# EasyEDA Pro project ProPrj_Decatron_2026-03-23.epro

# Schematic Schematic1
Board Name: Old; Create Date: 2024-11-02; Page Name: P1; Project Name: Decatron; Schematic Name: Schematic1; Update Date: 2026-03-20; Add into BOM: yes; Convert to PCB: yes; Drawed: MacLaod; Page Size: A4; Version: 2.1
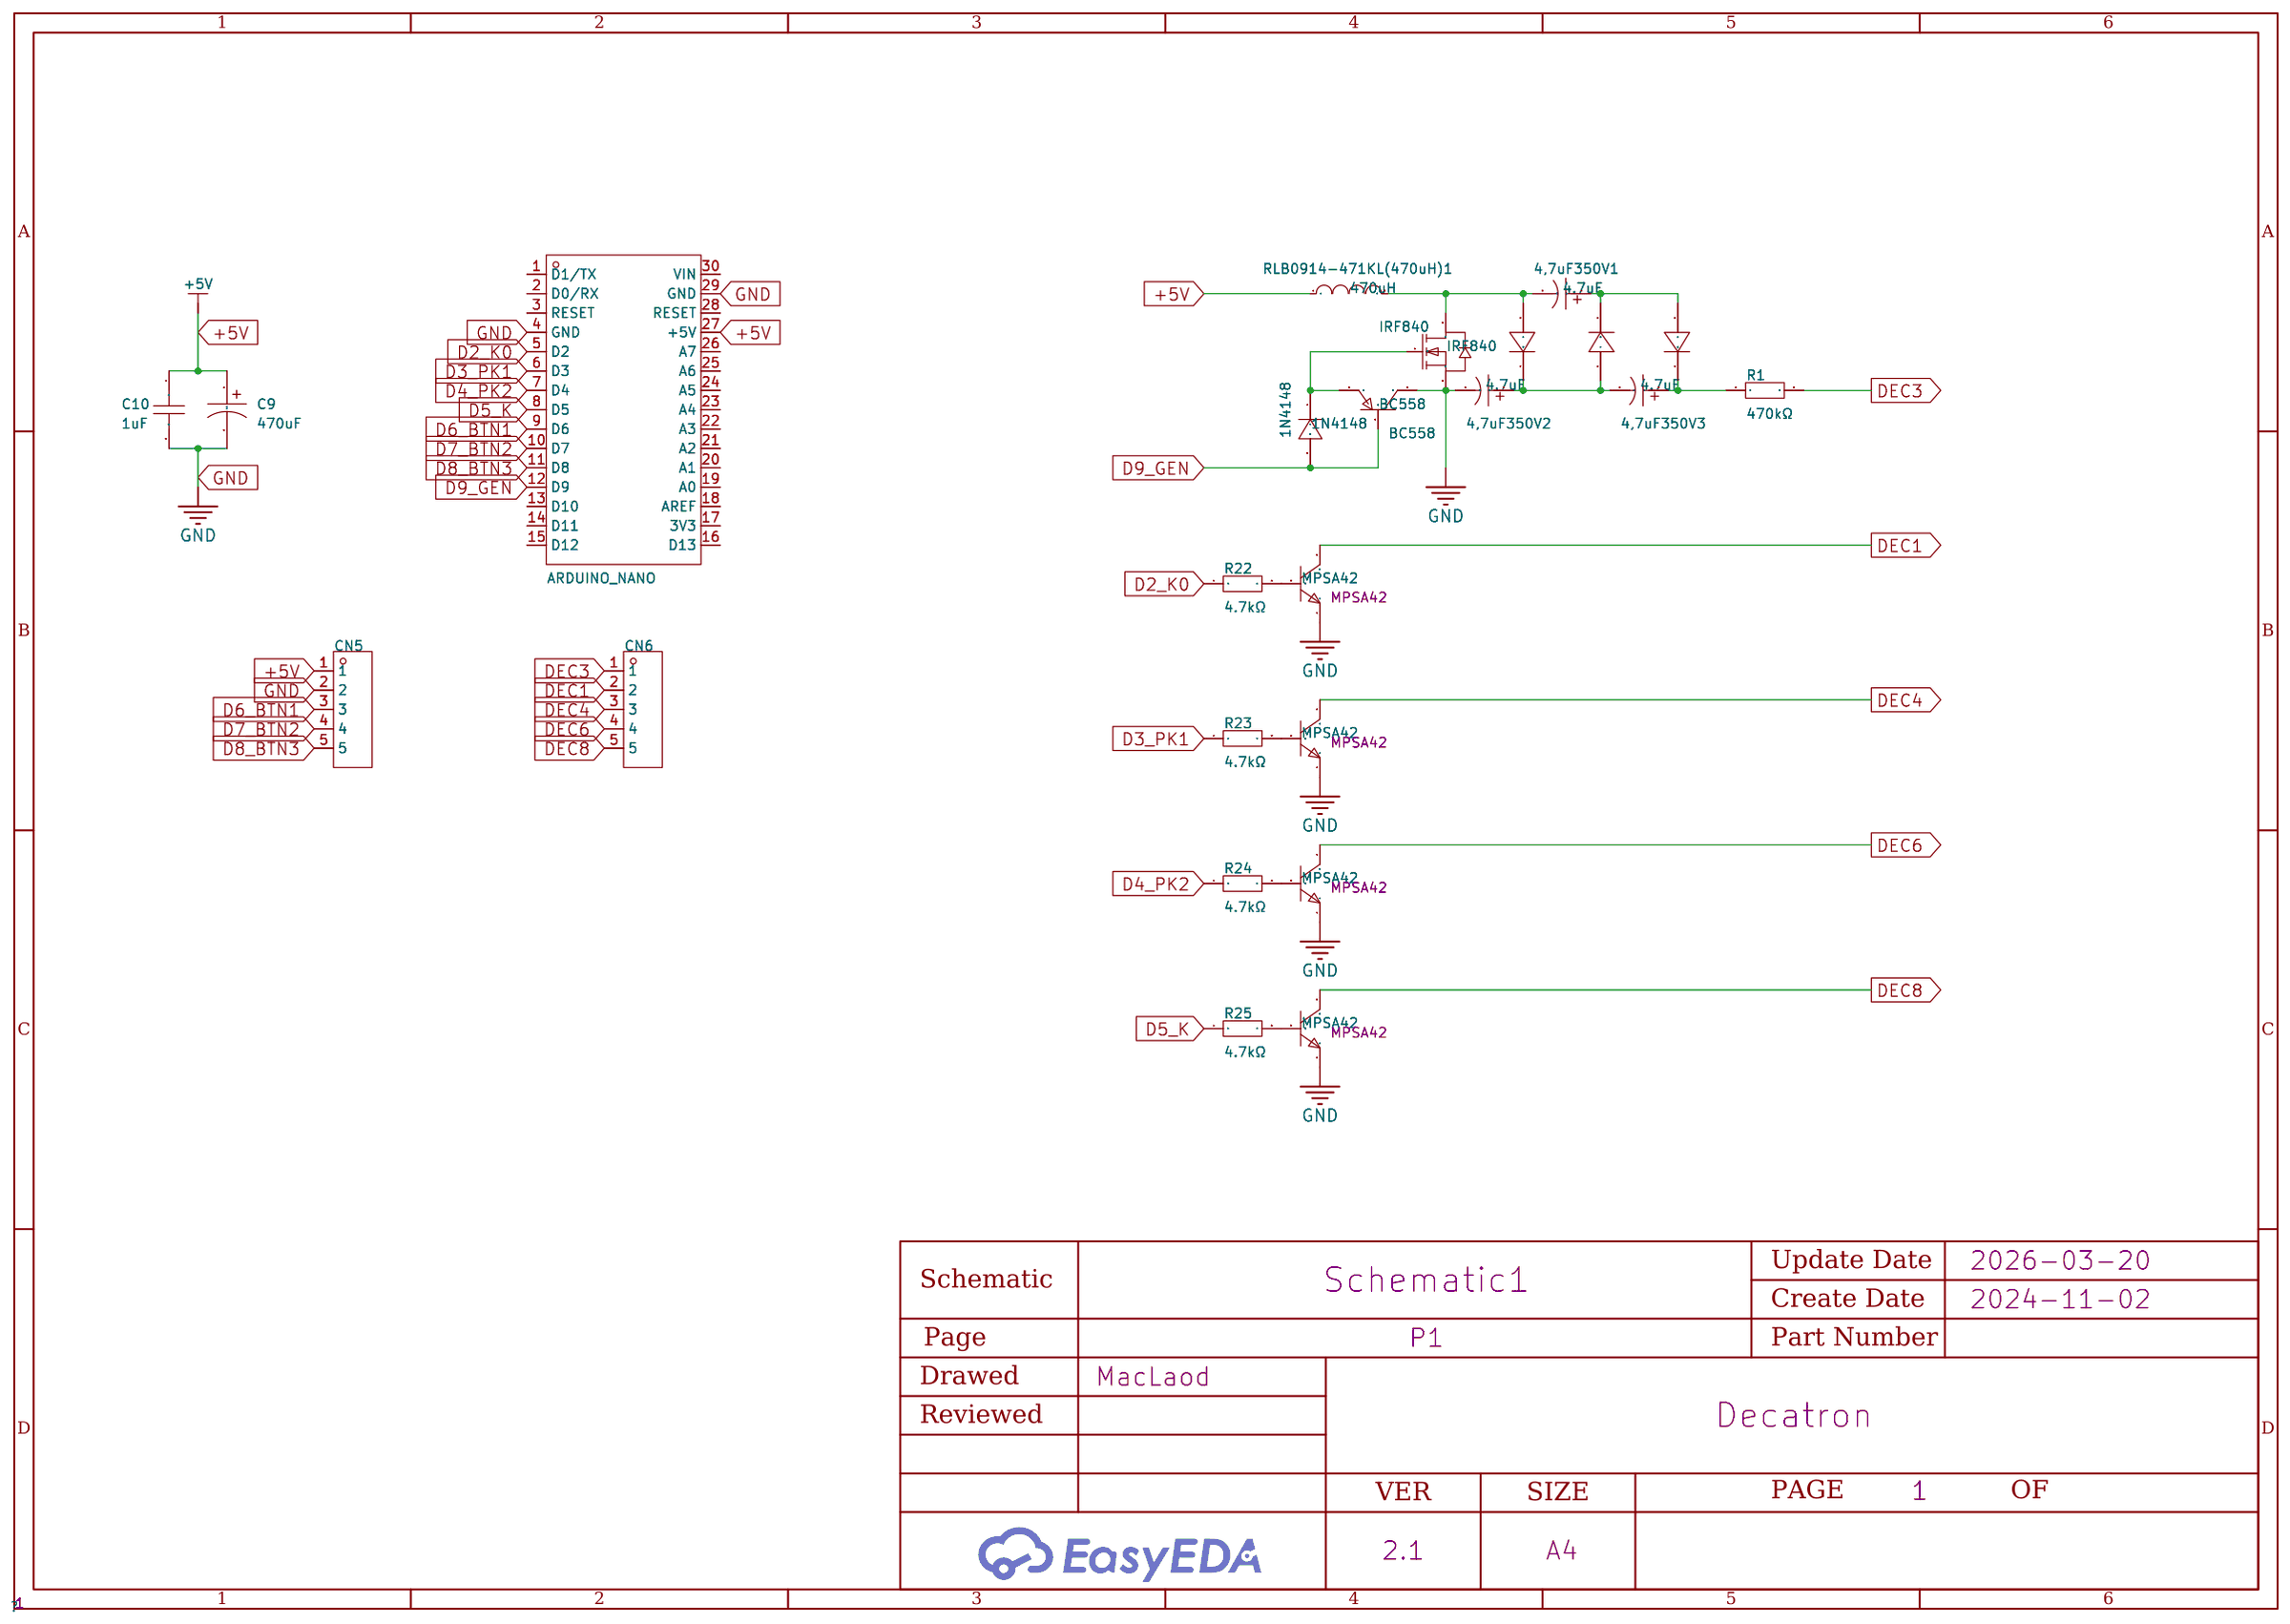
[diagram p0: schematic sheet]

## Parts
1N4148  1N4148  [DO-35_BD2.0-L4.0-P8.00-D0.5-FD]
4,7uF350V1  4.7uF  [CAP-TH_BD8.0-P3.50-D0.6-FD_1]
4,7uF350V2  4.7uF  [CAP-TH_BD8.0-P3.50-D0.6-FD_1]
4,7uF350V3  4.7uF  [CAP-TH_BD8.0-P3.50-D0.6-FD_1]
BC558  BC558  [TO-92-3_L4.5-W3.5-P1.27-L]
C9  470uF  [CAP-TH_BD6.3-P2.50-D1.0-FD]
C10  1uF  [C0805]
CN5  HX PM2.54-1x5P ZC-Y  [HDR-TH_5P-P2.54-V-F-3]
CN6  HX PM2.54-1x5P ZC-Y  [HDR-TH_5P-P2.54-V-F-3]
IRF840  IRF840  [TO-220AB-3_L10.4-W4.6-P2.54-L]
Q1  MPSA42  [TO-92-3_L4.9-W3.7-P1.27-L]
Q2  MPSA42  [TO-92-3_L4.9-W3.7-P1.27-L]
Q3  MPSA42  [TO-92-3_L4.9-W3.7-P1.27-L]
Q4  MPSA42  [TO-92-3_L4.9-W3.7-P1.27-L]
R1  470kΩ  [RES-TH_BD2.3-L6.5-P10.50-D0.5]
R22  4.7kΩ  [RES-TH_BD2.3-L6.5-P10.50-D0.5]
R23  4.7kΩ  [RES-TH_BD2.3-L6.5-P10.50-D0.5]
R24  4.7kΩ  [RES-TH_BD2.3-L6.5-P10.50-D0.5]
R25  4.7kΩ  [RES-TH_BD2.3-L6.5-P10.50-D0.5]
RLB0914-471KL(470uH)1  470uH  [IND-TH_BD8.7-P5.0-D0.7_RLB0914]
SF1  SF18  [DO-41_BD2.4-L4.7-P8.70-D0.9-FD]
SF2  SF18  [DO-41_BD2.4-L4.7-P8.70-D0.9-FD]
SF18  SF18  [DO-41_BD2.4-L4.7-P8.70-D0.9-FD]
U3  ARDUINO_NANO  [COMM-TH_ARDUINO_NANO]

## Library data of the parts
1N4148 = 1N4148_C14516: Diode Configuration: Forward Voltage (Vf@If):1V@10mA Reverse Voltage (Vr): Average Rectified Current (Io): Power Dissipation: Reverse Leakage Current:5uA@75V Reverse Recovery Time (trr): Operating Temperature:- Operating Temperature:-; LCSC Part Name: 电压:75V 电流:200mA; Supplier Part: C14516; Manufacturer: ST(先科); Supplier Footprint: DO-35; JLCPCB Part Class: Extended Part; Datasheet: https://atta.szlcsc.com/upload/public/pdf/source/20140303/1457707005030.pdf; Supplier: LCSC; Forward Voltage (Vf@If): 1V@10mA; Reverse Leakage Current: 5uA@75V
4,7uF350V1-4,7uF350V3 = 87EC0068: Capacitance: Tolerance:±20% Tolerance:±20% Rated Voltage: Ripple Current:150mA@100kHz Equivalent Series Resistance(ESR):3Ω@100kHz Lead Spacing: φD: L: Lifetime @ Temp:10000hrs@105℃ Operating Temperature:-25℃~+105℃ Operating Temperature:-25℃~+105℃; LCSC Part Name: 4.7uF ±20% 400V; Supplier Part: C2687411; Manufacturer: KNSCHA(科尼盛); Supplier Footprint: 插件,D8xL12mm; JLCPCB Part Class: Extended Part; Datasheet: https://atta.szlcsc.com/upload/public/pdf/source/20210128/C2687411_47D152122E02B3F51C123914ADA73DFA.pdf; Supplier: LCSC; Tolerance: ±20%; Ripple Current: 150mA@100kHz; Equivalent Series Resistance(ESR): 3Ω@100kHz; Lifetime @ Temp: 10000hrs@105℃; Operating Temperature: -25℃~+105℃; Check: true
BC558 = BC558: Transistor Type:PNP; LCSC Part Name: PNP; Supplier Part: C2992048; Manufacturer: CJ(江苏长电/长晶); Supplier Footprint: TO-92-3; JLCPCB Part Class: Extended Part; Datasheet: https://atta.szlcsc.com/upload/public/pdf/source/20220322/DC27FE3E0FF921B85DFD6DFB131647DC.pdf; Supplier: LCSC; Transistor Type: PNP; Check: true
C9 = SHW470UF6.3V6.3X11: Capacitance:470uF Tolerance:±20% Tolerance:±20% Voltage Rating:6.3V Ripple Current:- Equivalent Series Resistance(ESR):- Pin Spacing:2.5mm Diameter:6.3mm Height - Seated (Max):11mm Lifetime:10000hrs@105℃; LCSC Part Name: 470uF ±20% 6.3V 停产; Supplier Part: C494546; Manufacturer: KNSCHA(科尼盛); Supplier Footprint: 插件,D6.3xL11mm; JLCPCB Part Class: Extended Part; Datasheet: https://item.szlcsc.com/datasheet/SHW470UF6.3V6.3X11/505122.html; Supplier: LCSC; Tolerance: ±20%; Voltage Rating: 6.3V; Pin Spacing: 2.5mm; Diameter: 6.3mm; Height - Seated (Max): 11mm; Lifetime: 10000hrs@105℃
C10 = 0805B105K500NT_C215803: Capacitance:1uF Tolerance:±10% Tolerance:±10% Voltage Rating:50V Temperature Coefficient:X7R; LCSC Part Name: 1uF ±10% 50V; Supplier Part: C215803; Manufacturer: FH(风华); Manufacturer Part: 0805B105K500NT; Supplier Footprint: 0805; JLCPCB Part Class: Extended Part; Datasheet: https://item.szlcsc.com/datasheet/0805B105K500NT/216551.html; Supplier: LCSC; Tolerance: ±10%; Voltage Rating: 50V; Temperature Coefficient: X7R
CN5 CN6 = HX PM2.54-1x5P ZC-Y: Holes Structure:1x5P Pitch:2.54mm Row Spacing:- Circular Hole / Square Hole:Square Hole Mounting Type:Through Hole Number of Rows:1 Number of Positions:5P Current Rating:3A Voltage Rating (Max):1kV Holes Direction:Top Insulation Height:8.5mm Contact Mater; LCSC Part Name: 1x5P 间距:2.54mm 直插; Supplier Part: C22438155; Manufacturer: hanxia(韩下); Supplier Footprint: 插件,P=2.54mm; JLCPCB Part Class: Extended Part; Datasheet: https://item.szlcsc.com/datasheet/HX%2520PM2.54-1x5P%2520ZC-Y/24075302.html; Supplier: LCSC; Holes Structure: 1x5P; Pitch: 2.54mm; Circular Hole / Square Hole: Square Hole; Mounting Type: Through Hole; Number of Rows: 1; Number of Positions: 5P; Current Rating: 3A; Voltage Rating (Max): 1kV; Holes Direction: Top; Insulation Height: 8.5mm; Contact Material: Phosphor Bronze; Contact Plating: Gold; Operating Temperature: -40℃~+105℃; PIN Length: 3.2mm
IRF840 = IRF840_C3280796: Type:1个NChannel Drain Source Voltage (Vdss): Continuous Drain Current (Id): Power Dissipation (Pd): Drain Source On Resistance (RDS(on)@Vgs,Id): Gate Threshold Voltage (Vgs(th)@Id):4V@250uA Total Gate Charge (Qg@Vgs):63nC@10V Input Capacitance (Ciss@Vds):; LCSC Part Name: 1个N沟道 耐压:500V 电流:8A; Supplier Part: C3280796; Manufacturer: MOTOROLA(摩托罗拉); Supplier Footprint: TO-220AB; JLCPCB Part Class: Extended Part; Supplier: LCSC; Type: 1个NChannel; Gate Threshold Voltage (Vgs(th)@Id): 4V@250uA; Total Gate Charge (Qg@Vgs): 63nC@10V; Input Capacitance (Ciss@Vds): 1.3nF@25V; Operating Temperature: -55℃~+150℃@(Tj)
Q1-Q4 = MPSA42_C2978815: type:NPN Current - Collector(Ic):500mA Collector - Emitter Voltage VCEO:300V Pd - Power Dissipation:625mW Transition frequency(fT):50MHz Current - Collector Cutoff:100nA Vce Saturation(VCE(sat)):500mV@20mA,2mA Emitter-Base Voltage(Vebo):6V; Supplier Part: C2978815; Manufacturer: EIC; Supplier Footprint: TO-92; JLCPCB Part Class: Extended Part; Datasheet: https://item.szlcsc.com/datasheet/MPSA42/3393640.html; Supplier: LCSC; type: NPN; Current - Collector(Ic): 500mA; Collector - Emitter Voltage VCEO: 300V; Pd - Power Dissipation: 625mW; Transition frequency(fT): 50MHz; Current - Collector Cutoff: 100nA; Vce Saturation(VCE(sat)): 500mV@20mA,2mA; Emitter-Base Voltage(Vebo): 6V
R1 = MF1/4W-470KΩ±1% T: Type:Metal Film Resistors Resistance: Tolerance:±1% Tolerance:±1% Overload Voltage (Max):250V Power(Watts):250mW Temperature Coefficient:±100ppm/℃ Temperature Coefficient:±100ppm/℃ Operating Temperature Range:-55℃~+155℃ Operating Temperature Range:-55℃~+1; LCSC Part Name: 470kΩ ±1% 250mW 金属膜电阻; Supplier Part: C119381; Manufacturer: CCO(千志电子); Supplier Footprint: 插件,D2.3xL6.5mm; JLCPCB Part Class: Extended Part; Datasheet: https://atta.szlcsc.com/upload/public/pdf/source/20190910/C427326_62A6D058BC0FF74963A2F22379CA06CE.pdf; Supplier: LCSC; Type: Metal Film Resistors; Tolerance: ±1%; Overload Voltage (Max): 250V; Power(Watts): 250mW; Temperature Coefficient: ±100ppm/℃; Operating Temperature Range: -55℃~+155℃; Check: true
R22-R25 = MF1/4W-4.7KΩ±1% T: Type:Metal Film Resistors Resistance: Tolerance:±1% Tolerance:±1% Overload Voltage (Max):250V Power(Watts):250mW Temperature Coefficient:±100ppm/℃ Temperature Coefficient:±100ppm/℃ Operating Temperature Range:-55℃~+155℃ Operating Temperature Range:-55℃~+1; LCSC Part Name: 4.7kΩ ±1% 250mW 金属膜电阻; Supplier Part: C119339; Manufacturer: CCO(千志电子); Supplier Footprint: 插件,D2.3xL6.5mm; JLCPCB Part Class: Extended Part; Datasheet: https://atta.szlcsc.com/upload/public/pdf/source/20190910/C427326_62A6D058BC0FF74963A2F22379CA06CE.pdf; Supplier: LCSC; Type: Metal Film Resistors; Tolerance: ±1%; Overload Voltage (Max): 250V; Power(Watts): 250mW; Temperature Coefficient: ±100ppm/℃; Operating Temperature Range: -55℃~+155℃; Check: true
RLB0914-471KL(470uH)1 = RLB0914-471KL: Inductance: Tolerance:±10% Tolerance:±10% Rated Current: Saturation Current (Isat):1A DC Resistance (DCR):; LCSC Part Name: 470uH ±10% 1A; Supplier Part: C7051049; Manufacturer: BOURNS; Supplier Footprint: 插件,D=8.7mm; JLCPCB Part Class: Extended Part; Datasheet: https://atta.szlcsc.com/upload/public/pdf/source/20210607/5640BD4660BD3B6D9DDA3618CD6274B0.pdf; Supplier: LCSC; Tolerance: ±10%; Saturation Current (Isat): 1A; Check: true
SF1 SF2 SF18 = SF18_C2473: Diode Configuration: Forward Voltage (Vf@If):1.7V@1A Reverse Voltage (Vr): Rectified Current: Reverse Leakage Current:5uA@600V Reverse Recovery Time (trr): Operating Temperature:-65℃~+150℃@(Tj) Operating Temperature:-65℃~+150℃@(Tj); LCSC Part Name: 电压:600V 电流:1A; Supplier Part: C2473; Manufacturer: MDD(辰达半导体); Supplier Footprint: DO-41; JLCPCB Part Class: Extended Part; Datasheet: https://atta.szlcsc.com/upload/public/pdf/source/20230823/CFE61843E68648CCDB3FF9A5105FB01C.pdf; Supplier: LCSC; Forward Voltage (Vf@If): 1.7V@1A; Reverse Leakage Current: 5uA@600V; Operating Temperature: -65℃~+150℃@(Tj); Check: true
U3 = ARDUINO_NANO: Supplier Part: C9900017879; Supplier Footprint: 插件; JLCPCB Part Class: Extended Part; Supplier: LCSC

## Nets
+5V: C9.1 C10.1 CN5.1 RLB0914-471KL(470uH)1.1 U3.27(+5V)
GND: 4,7uF350V2.2 BC558.3(C) C9.2 C10.2 CN5.2 IRF840.3(S) Q1.1(E) Q2.1(E) Q3.1(E) Q4.1(E) U3.4(GND) U3.29(GND)
D2_K0: R22.1 U3.5(D2)
D3_PK1: R23.1 U3.6(D3)
D4_PK2: R24.1 U3.7(D4)
D5_K: R25.1 U3.8(D5)
D6_BTN1: CN5.3 U3.9(D6)
D7_BTN2: CN5.4 U3.10(D7)
D8_BTN3: CN5.5 U3.11(D8)
D9_GEN: 1N4148.2 BC558.2(B) U3.12(D9)
DEC1: CN6.2 Q4.3(C)
DEC3: CN6.1 R1.2
DEC4: CN6.3 Q3.3(C)
DEC6: CN6.4 Q2.3(C)
DEC8: CN6.5 Q1.3(C)
$1N16358: 4,7uF350V1.1 SF1.1(C) SF2.2(A)
$1N16362: 4,7uF350V3.1 R1.1 SF2.1(C)
$1N16381: 4,7uF350V2.1 4,7uF350V3.2 SF1.2(A) SF18.1(C)
$1N16382: 4,7uF350V1.2 IRF840.2(D) RLB0914-471KL(470uH)1.2 SF18.2(A)
$1N16384: Q2.2(B) R24.2
$1N16385: Q1.2(B) R25.2
$1N16390: Q3.2(B) R23.2
$1N16391: Q4.2(B) R22.2
$1N16392: 1N4148.1 BC558.1(E) IRF840.1(G)

Not connected (* = marked no-connect by the designer): U3 1(D1/TX) 2(D0/RX) 3(RESET) 13(D10) 14(D11) 15(D12) 16(D13) 17(3V3) 18(AREF) 19(A0) 20(A1) 21(A2) 22(A3) 23(A4) 24(A5) 25(A6) 26(A7) 28(RESET) 30(VIN)

# Schematic Schematic2
Board Name: New; Create Date: 2026-03-18; Page Name: P1_1; Project Name: Decatron; Schematic Name: Schematic2; Update Date: 2026-03-20; Add into BOM: yes; Convert to PCB: yes
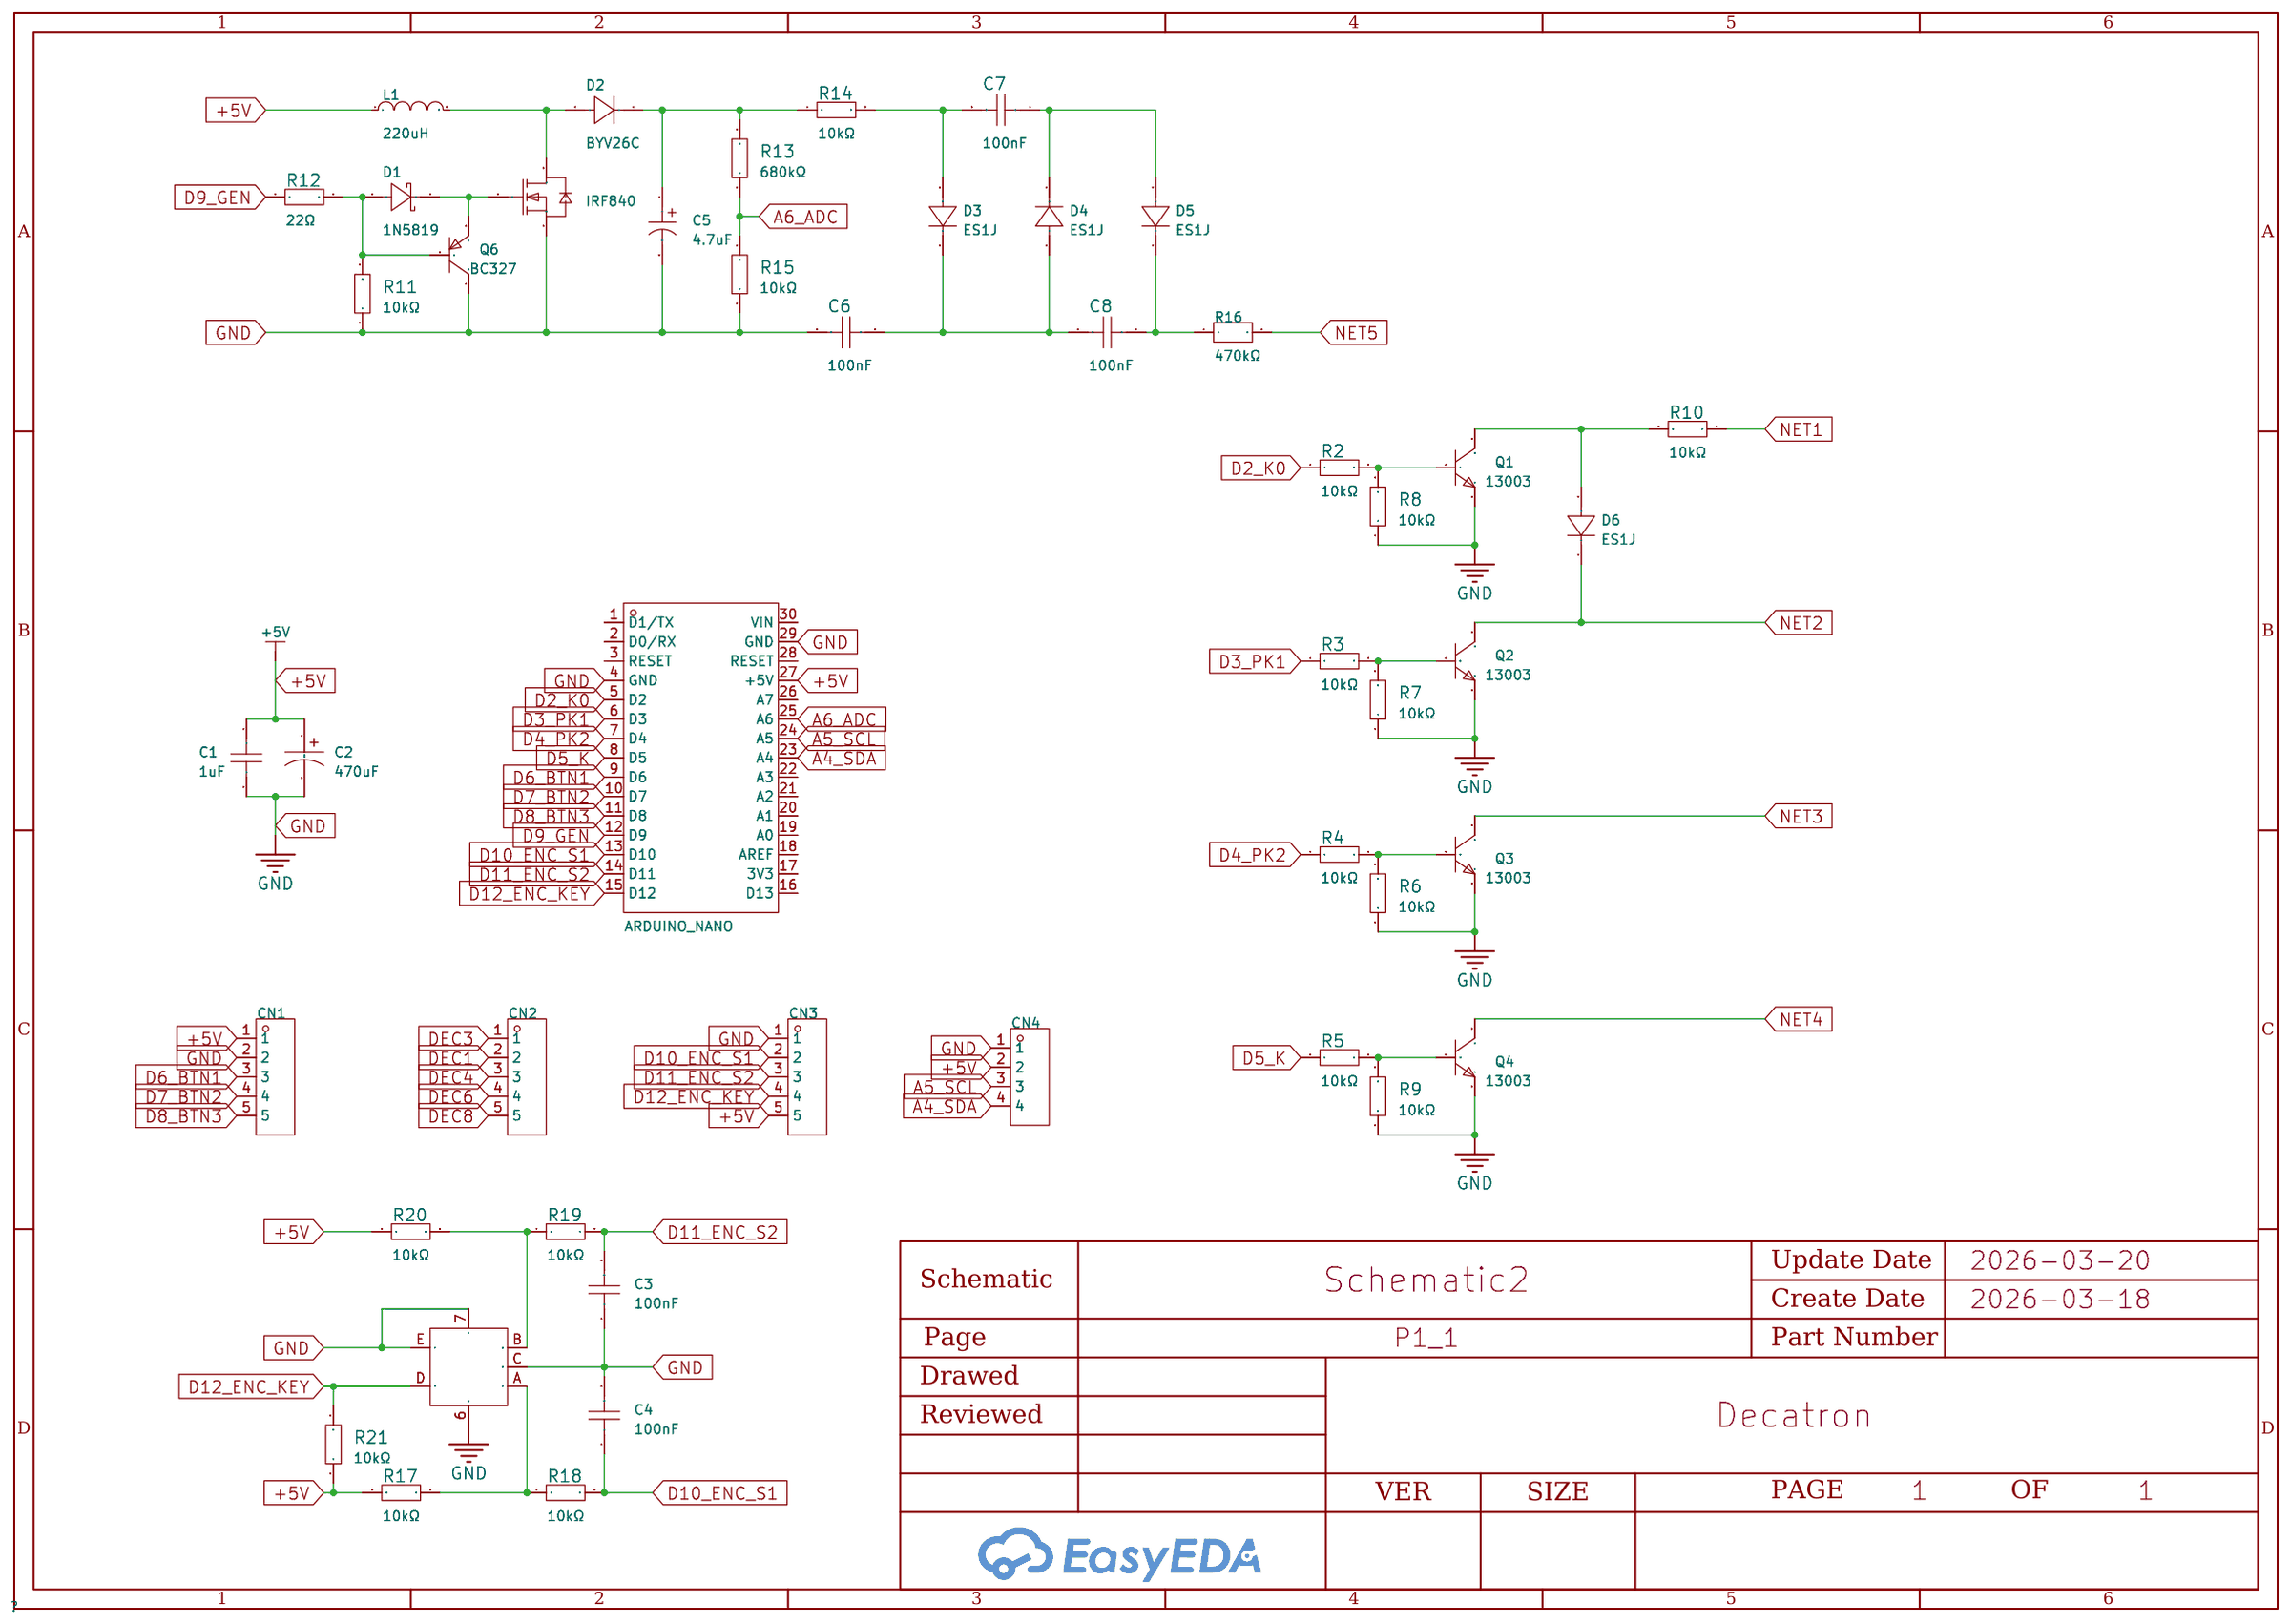
[diagram p1: schematic sheet]

## Parts
C1  1uF  [C0805]
C2  470uF  [CAP-TH_BD6.3-P2.50-D1.0-FD]
C3  100nF  [C1206]
C4  100nF  [C1206]
C5  4.7uF  [CAP-TH_BD8.0-P3.50-D0.6-FD]
C6  100nF  [C1210]
C7  100nF  [C1210]
C8  100nF  [C1210]
CN1  HX PM2.54-1x5P ZC-Y  [HDR-TH_5P-P2.54-V-F-3]
CN2  HX PM2.54-1x5P ZC-Y  [HDR-TH_5P-P2.54-V-F-3]
CN3  HX PM2.54-1x5P ZC-Y  [HDR-TH_5P-P2.54-V-F-3]
CN4  HX PM2.54-1x4P ZC-Y  [HDR-TH_4P-P2.54-V-F]
D1  1N5819  [DO-41_BD2.4-L4.7-P8.70-D0.9-RD]
D2  BYV26C  [DO-41_BD2.6-L5.1-P9.00-D0.8-RD]
D3  ES1J  [SMA_L4.5-W2.6-LS5.1-RD-1]
D4  ES1J  [SMA_L4.5-W2.6-LS5.1-RD-1]
D5  ES1J  [SMA_L4.5-W2.6-LS5.1-RD-1]
D6  ES1J  [SMA_L4.5-W2.6-LS5.1-RD-1]
L1  220uH  [IND-SMD_L10.1-W10.1_SLF10145T]
Q1  13003  [TO-252-2_L6.6-W6.1-P4.57-LS9.9-BR-CW]
Q2  13003  [TO-252-2_L6.6-W6.1-P4.57-LS9.9-BR-CW]
Q3  13003  [TO-252-2_L6.6-W6.1-P4.57-LS9.9-BR-CW]
Q4  13003  [TO-252-2_L6.6-W6.1-P4.57-LS9.9-BR-CW]
Q5  IRF840  [TO-220-3_L10.0-W4.5-P2.54-L]
Q6  BC327  [TO-92-3_L4.8-W3.7-P1.27-L-1]
R2  10kΩ  [R1206]
R3  10kΩ  [R1206]
R4  10kΩ  [R1206]
R5  10kΩ  [R1206]
R6  10kΩ  [R1206]
R7  10kΩ  [R1206]
R8  10kΩ  [R1206]
R9  10kΩ  [R1206]
R10  10kΩ  [R1206]
R11  10kΩ  [R0805]
R12  22Ω  [R0805]
R13  680kΩ  [R0805]
R14  10kΩ  [R0805]
R15  10kΩ  [R0805]
R16  470kΩ  [R2512]
R17  10kΩ  [R1206]
R18  10kΩ  [R1206]
R19  10kΩ  [R1206]
R20  10kΩ  [R1206]
R21  10kΩ  [R1206]
SW1  EC11B152442D-STEC11B03  [SW-TH_EC11B152442D-STEC11B03]
U2  ARDUINO_NANO  [COMM-TH_ARDUINO_NANO]

## Library data of the parts
C1 = 0805B105K500NT_C215803: Capacitance:1uF Tolerance:±10% Tolerance:±10% Voltage Rating:50V Temperature Coefficient:X7R; LCSC Part Name: 1uF ±10% 50V; Supplier Part: C215803; Manufacturer: FH(风华); Manufacturer Part: 0805B105K500NT; Supplier Footprint: 0805; JLCPCB Part Class: Extended Part; Datasheet: https://item.szlcsc.com/datasheet/0805B105K500NT/216551.html; Supplier: LCSC; Tolerance: ±10%; Voltage Rating: 50V; Temperature Coefficient: X7R
C2 = SHW470UF6.3V6.3X11: Capacitance:470uF Tolerance:±20% Tolerance:±20% Voltage Rating:6.3V Ripple Current:- Equivalent Series Resistance(ESR):- Pin Spacing:2.5mm Diameter:6.3mm Height - Seated (Max):11mm Lifetime:10000hrs@105℃; LCSC Part Name: 470uF ±20% 6.3V 停产; Supplier Part: C494546; Manufacturer: KNSCHA(科尼盛); Supplier Footprint: 插件,D6.3xL11mm; JLCPCB Part Class: Extended Part; Datasheet: https://item.szlcsc.com/datasheet/SHW470UF6.3V6.3X11/505122.html; Supplier: LCSC; Tolerance: ±20%; Voltage Rating: 6.3V; Pin Spacing: 2.5mm; Diameter: 6.3mm; Height - Seated (Max): 11mm; Lifetime: 10000hrs@105℃
C3 C4 = 12063F104K4T2A: Capacitance: Tolerance:±10% Tolerance:±10% Voltage Rated: Temperature Coefficient:; LCSC Part Name: 100nF ±10% 25V; Supplier Part: C1951704; Manufacturer: Kyocera AVX; Supplier Footprint: 1206; JLCPCB Part Class: Extended Part; Datasheet: https://atta.szlcsc.com/upload/public/pdf/source/20210702/CAE02EDADB802B7892A1FEA38984365F.pdf; Supplier: LCSC; Tolerance: ±10%
C5 = OLKD1152G4R7MF: Capacitance:4.7uF Tolerance:±20% Tolerance:±20% Voltage Rating:400V Diameter:8mm Height - Seated (Max):11.5mm; LCSC Part Name: 4.7uF ±20% 400V; Supplier Part: C22391570; Manufacturer: Ymin(永铭); Supplier Footprint: 插件,D8xL11.5mm; JLCPCB Part Class: Extended Part; Supplier: LCSC; Tolerance: ±20%; Voltage Rating: 400V; Diameter: 8mm; Height - Seated (Max): 11.5mm
C6-C8 = GR332DD72W104KW01L: Capacitance: Tolerance:±10% Tolerance:±10% Voltage Rated: Temperature Coefficient:; LCSC Part Name: 100nF ±10% 450V; Supplier Part: C161352; Manufacturer: muRata(村田); Supplier Footprint: 1210; JLCPCB Part Class: Extended Part; Datasheet: https://atta.szlcsc.com/upload/public/pdf/source/20180412/C161352_9A335A248A9C751050C4DDC87E0AB306.pdf; Supplier: LCSC; Tolerance: ±10%
CN1-CN3 = HX PM2.54-1x5P ZC-Y: Holes Structure:1x5P Pitch:2.54mm Row Spacing:- Circular Hole / Square Hole:Square Hole Mounting Type:Through Hole Number of Rows:1 Number of Positions:5P Current Rating:3A Voltage Rating (Max):1kV Holes Direction:Top Insulation Height:8.5mm Contact Mater; LCSC Part Name: 1x5P 间距:2.54mm 直插; Supplier Part: C22438155; Manufacturer: hanxia(韩下); Supplier Footprint: 插件,P=2.54mm; JLCPCB Part Class: Extended Part; Datasheet: https://item.szlcsc.com/datasheet/HX%2520PM2.54-1x5P%2520ZC-Y/24075302.html; Supplier: LCSC; Holes Structure: 1x5P; Pitch: 2.54mm; Circular Hole / Square Hole: Square Hole; Mounting Type: Through Hole; Number of Rows: 1; Number of Positions: 5P; Current Rating: 3A; Voltage Rating (Max): 1kV; Holes Direction: Top; Insulation Height: 8.5mm; Contact Material: Phosphor Bronze; Contact Plating: Gold; Operating Temperature: -40℃~+105℃; PIN Length: 3.2mm
CN4 = HX PM2.54-1x4P ZC-Y: Holes Structure:1x4P Pitch:2.54mm Row Spacing:- Circular Hole / Square Hole:Square Hole Mounting Type:Through Hole Number of Rows:1 Number of Positions:4P Current Rating:3A Voltage Rating (Max):1kV Holes Direction:Top Insulation Height:8.5mm Contact Mater; LCSC Part Name: 1x4P 间距:2.54mm 直插; Supplier Part: C22438154; Manufacturer: hanxia(韩下); Supplier Footprint: 插件,P=2.54mm; JLCPCB Part Class: Extended Part; Datasheet: https://item.szlcsc.com/datasheet/HX%2520PM2.54-1x4P%2520ZC-Y/24075301.html; Supplier: LCSC; Holes Structure: 1x4P; Pitch: 2.54mm; Circular Hole / Square Hole: Square Hole; Mounting Type: Through Hole; Number of Rows: 1; Number of Positions: 4P; Current Rating: 3A; Voltage Rating (Max): 1kV; Holes Direction: Top; Insulation Height: 8.5mm; Contact Material: Phosphor Bronze; Contact Plating: Gold; Operating Temperature: -40℃~+105℃; PIN Length: 3.2mm
D1 = 1N5819_C27636129: Voltage - Forward(Vf@If):600mV@1.0A Voltage - DC Reverse(Vr):40V Current - Rectified:1A Operating Junction Temperature Range:-65℃~+125℃ Operating Junction Temperature Range:-65℃~+125℃ Non-Repetitive Peak Forward Surge Current:25A; LCSC Part Name: 电压:40V 电流:1A; Supplier Part: C27636129; Manufacturer: DOWO(东沃); Supplier Footprint: DO-41; JLCPCB Part Class: Extended Part; Datasheet: https://item.szlcsc.com/datasheet/1N5819/29373164.html; Supplier: LCSC; Voltage - Forward(Vf@If): 600mV@1.0A; Voltage - DC Reverse(Vr): 40V; Current - Rectified: 1A; Operating Junction Temperature Range: -65℃~+125℃; Non-Repetitive Peak Forward Surge Current: 25A
D2 = BYV26C: Diode Configuration:Independent Voltage - Forward(Vf@If):2.5V@1A Voltage - DC Reverse(Vr):600V Current - Rectified:1A Reverse Leakage Current (Ir):5uA@600V Reverse Recovery Time (trr):30ns Operating Junction Temperature Range:-55℃~+150℃@(Tj) Operating Jun; LCSC Part Name: 耐压:600V 电流:1A 反向恢复时间：30ns; Supplier Part: C2903806; Manufacturer: LGE(鲁光); Supplier Footprint: DO-41; JLCPCB Part Class: Extended Part; Datasheet: https://item.szlcsc.com/datasheet/BYV26C/3160571.html; Supplier: LCSC; Diode Configuration: Independent; Voltage - Forward(Vf@If): 2.5V@1A; Voltage - DC Reverse(Vr): 600V; Current - Rectified: 1A; Reverse Leakage Current (Ir): 5uA@600V; Reverse Recovery Time (trr): 30ns; Operating Junction Temperature Range: -55℃~+150℃@(Tj); Non-Repetitive Peak Forward Surge Current: 30A
D3-D6 = ES1J_C698722: Diode Configuration:Independent Type Forward Voltage (Vf@If):1.7V@1A Reverse Voltage (Vr): Rectified Current: Reverse Leakage Current:5uA@600V Reverse Recovery Time (trr): Operating Temperature:-55℃~+150℃@(Tj) Operating Temperature:-55℃~+150℃@(Tj); Supplier Part: C698722; Manufacturer: YANGJIE(扬杰); Supplier Footprint: SMA(DO-214AC); JLCPCB Part Class: Extended Part; Datasheet: https://atta.szlcsc.com/upload/public/pdf/source/20190516/C393515_02E03A2FBEE03F1073F51BCEF5BA3628.pdf; Supplier: LCSC; Diode Configuration: Independent Type; Forward Voltage (Vf@If): 1.7V@1A; Reverse Leakage Current: 5uA@600V; Operating Temperature: -55℃~+150℃@(Tj)
L1 = SLF10145T-221MR65-PF: Inductance:220uH Tolerance:±20% Tolerance:±20% Current Rating:650mA Current - Saturation(Isat):650mA DC Resistance(DCR):564mΩ Type:- Ratings:-; LCSC Part Name: 220uH ±20% 650mA; Supplier Part: C122813; Manufacturer: TDK; Supplier Footprint: SMD,10.1x10.1mm; JLCPCB Part Class: Extended Part; Datasheet: https://item.szlcsc.com/datasheet/SLF10145T-221MR65-PF/124083.html; Supplier: LCSC; Tolerance: ±20%; Current Rating: 650mA; Current - Saturation(Isat): 650mA; DC Resistance(DCR): 564mΩ
Q1-Q4 = 13003_C22396423: type:NPN Current - Collector(Ic):1.5A Collector - Emitter Voltage VCEO:480V Pd - Power Dissipation:1.25W DC Current Gain:40@0.5A,5V DC Current Gain:40@0.5A,5V Transition frequency(fT):5MHz Current - Collector Cutoff:500uA Vce Saturation(VCE(sat)):500mV@0.; LCSC Part Name: NPN 电流:1.5A 电压:480V; Supplier Part: C22396423; Manufacturer: HXY MOSFET(华轩阳电子); Supplier Footprint: TO-252-2L; JLCPCB Part Class: Extended Part; Datasheet: https://item.szlcsc.com/datasheet/13003/24000894.html; Supplier: LCSC; type: NPN; Current - Collector(Ic): 1.5A; Collector - Emitter Voltage VCEO: 480V; Pd - Power Dissipation: 1.25W; DC Current Gain: 40@0.5A,5V; Transition frequency(fT): 5MHz; Current - Collector Cutoff: 500uA; Vce Saturation(VCE(sat)): 500mV@0.5A,200mA; Operating Temperature: -55℃~+150℃; Emitter-Base Voltage(Vebo): 9V
Q5 = IRF840_C20607747: Drain to Source Voltage:500V Current - Continuous Drain(Id):- RDS(on):- Pd - Power Dissipation:134W Gate Threshold Voltage (Vgs(th)@Id):4V Gate Charge(Qg):- Input Capacitance(Ciss@Vds):- Reverse Transfer Capacitance (Crss@Vds):20pF@25V Operating Temperatu; LCSC Part Name: N沟道,电流:8A,耐压:500V; Supplier Part: C20607747; Manufacturer: OSEN(欧芯); Supplier Footprint: TO-220; JLCPCB Part Class: Extended Part; Datasheet: https://item.szlcsc.com/datasheet/IRF840/21953936.html; Supplier: LCSC; Drain to Source Voltage: 500V; Pd - Power Dissipation: 134W; Gate Threshold Voltage (Vgs(th)@Id): 4V; Reverse Transfer Capacitance (Crss@Vds): 20pF@25V
Q6 = BC327_C47089394: type:PNP Current - Collector(Ic):800mA Pd - Power Dissipation:625mW DC Current Gain:630@100mA,1V DC Current Gain:630@100mA,1V Transition frequency(fT):260MHz Vce Saturation(VCE(sat)):700mV@500mA,50mA Operating Temperature:-55℃~+150℃ Operating Temperature:; LCSC Part Name: hFE：60-400 PNP 电流:800mA; Supplier Part: C47089394; Manufacturer: CJ(江苏长电/长晶); Supplier Footprint: TO-92; JLCPCB Part Class: Extended Part; Datasheet: https://item.szlcsc.com/datasheet/BC327/49277184.html; Supplier: LCSC; type: PNP; Current - Collector(Ic): 800mA; Pd - Power Dissipation: 625mW; DC Current Gain: 630@100mA,1V; Transition frequency(fT): 260MHz; Vce Saturation(VCE(sat)): 700mV@500mA,50mA; Operating Temperature: -55℃~+150℃; Emitter-Base Voltage(Vebo): 5V; Number: 1 PNP
R2-R10 R17-R21 = RMC120610K1%N: Type:Thick Film Resistor Resistance:10kΩ Tolerance:±1% Tolerance:±1% Power(Watts):250mW Voltage-Supply(Max):200V Temperature Coefficient:±100ppm/℃ Temperature Coefficient:±100ppm/℃ Operating Temperature:-55℃~+155℃ Operating Temperature:-55℃~+155℃; LCSC Part Name: 10kΩ ±1% 250mW; Supplier Part: C269766; Manufacturer: Tyohm(幸亚电阻); Supplier Footprint: 1206; JLCPCB Part Class: Extended Part; Datasheet: https://item.szlcsc.com/datasheet/RMC120610K1%2525N/259206.html; Supplier: LCSC; Type: Thick Film Resistor; Tolerance: ±1%; Power(Watts): 250mW; Voltage-Supply(Max): 200V; Temperature Coefficient: ±100ppm/℃; Operating Temperature: -55℃~+155℃
R11 R14 R15 = RMC080510K1%N: Type:Thick Film Resistor Resistance:10kΩ Tolerance:±1% Tolerance:±1% Power(Watts):125mW Voltage-Supply(Max):150V Temperature Coefficient:±100ppm/℃ Temperature Coefficient:±100ppm/℃ Operating Temperature:-55℃~+155℃ Operating Temperature:-55℃~+155℃; LCSC Part Name: 厚膜电阻 10kΩ ±1% 125mW; Supplier Part: C269742; Manufacturer: Tyohm(幸亚电阻); Supplier Footprint: 0805; JLCPCB Part Class: Extended Part; Datasheet: https://item.szlcsc.com/datasheet/RMC080510K1%2525N/259182.html; Supplier: LCSC; Type: Thick Film Resistor; Tolerance: ±1%; Power(Watts): 125mW; Voltage-Supply(Max): 150V; Temperature Coefficient: ±100ppm/℃; Operating Temperature: -55℃~+155℃
R12 = 0805W8F220JT5E: Type:Thick Film Resistor Resistance:22Ω Tolerance:±1% Tolerance:±1% Power(Watts):125mW Voltage-Supply(Max):150V Temperature Coefficient:±100ppm/℃ Temperature Coefficient:±100ppm/℃ Operating Temperature:-55℃~+155℃ Operating Temperature:-55℃~+155℃; LCSC Part Name: 22Ω ±1% 125mW 厚膜电阻; Supplier Part: C17561; Manufacturer: UNI-ROYAL(厚声); Supplier Footprint: 0805; JLCPCB Part Class: Basic Part; Datasheet: https://item.szlcsc.com/datasheet/0805W8F220JT5E/18249.html; Supplier: LCSC; Type: Thick Film Resistor; Tolerance: ±1%; Power(Watts): 125mW; Voltage-Supply(Max): 150V; Temperature Coefficient: ±100ppm/℃; Operating Temperature: -55℃~+155℃
R13 = RMC0805680K1%N: Type:Thick Film Resistor Resistance:680kΩ Tolerance:±1% Tolerance:±1% Power(Watts):125mW Voltage-Supply(Max):150V Temperature Coefficient:±100ppm/℃ Temperature Coefficient:±100ppm/℃ Operating Temperature:-55℃~+155℃ Operating Temperature:-55℃~+155℃; LCSC Part Name: 厚膜电阻 680kΩ ±1% 125mW; Supplier Part: C325823; Manufacturer: Tyohm(幸亚电阻); Supplier Footprint: 0805; JLCPCB Part Class: Extended Part; Datasheet: https://item.szlcsc.com/datasheet/RMC0805680K1%2525N/306028.html; Supplier: LCSC; Type: Thick Film Resistor; Tolerance: ±1%; Power(Watts): 125mW; Voltage-Supply(Max): 150V; Temperature Coefficient: ±100ppm/℃; Operating Temperature: -55℃~+155℃
R16 = CRCW2512470KFKEG: Type:Thick Film Resistor Resistance:470kΩ Tolerance:±1% Tolerance:±1% Power(Watts):1W Voltage-Supply(Max):300V Temperature Coefficient:±100ppm/℃ Temperature Coefficient:±100ppm/℃ Operating Temperature:-55℃~+155℃ Operating Temperature:-55℃~+155℃; LCSC Part Name: 厚膜电阻 470kΩ ±1% 1W; Supplier Part: C2078500; Manufacturer: VISHAY(威世); Supplier Footprint: 2512; JLCPCB Part Class: Extended Part; Datasheet: https://item.szlcsc.com/datasheet/CRCW2512470KFKEG/2170087.html; Supplier: LCSC; Type: Thick Film Resistor; Tolerance: ±1%; Power(Watts): 1W; Voltage-Supply(Max): 300V; Temperature Coefficient: ±100ppm/℃; Operating Temperature: -55℃~+155℃
SW1 = EC11B152442D-STEC11B03: Supplier Part: C2830186; Manufacturer: ALPSALPINE(阿尔卑斯阿尔派); Supplier Footprint: 插件; JLCPCB Part Class: Extended Part; Datasheet: https://atta.szlcsc.com/upload/public/pdf/source/20210507/C2830186_6258EC626EFF75A690E03C224C1A6BB5.pdf; Supplier: LCSC
U2 = ARDUINO_NANO: Supplier Part: C9900017879; Supplier Footprint: 插件; JLCPCB Part Class: Extended Part; Supplier: LCSC

## Nets
+5V: C1.1 C2.1 CN1.1 CN3.5 CN4.2 L1.1 R17.1 R20.1 R21.1 U2.27(+5V)
GND: C1.2 C2.2 C3.1 C4.2 C5.2 C6.2 CN1.2 CN3.1 CN4.1 Q1.3(E) Q2.3(E) Q3.3(E) Q4.3(E) Q5.3(S) Q6.1(C) R6.1 R7.1 R8.1 R9.1 R11.1 R15.1 SW1.6 SW1.7 SW1.C SW1.E U2.4(GND) U2.29(GND)
A4_SDA: CN4.4 U2.23(A4)
A5_SCL: CN4.3 U2.24(A5)
A6_ADC: R13.1 R15.2 U2.25(A6)
D2_K0: R2.1 U2.5(D2)
D3_PK1: R3.1 U2.6(D3)
D4_PK2: R4.1 U2.7(D4)
D5_K: R5.1 U2.8(D5)
D6_BTN1: CN1.3 U2.9(D6)
D7_BTN2: CN1.4 U2.10(D7)
D8_BTN3: CN1.5 U2.11(D8)
D9_GEN: R12.1 U2.12(D9)
D10_ENC_S1: C4.1 CN3.2 R18.2 U2.13(D10)
D11_ENC_S2: C3.2 CN3.3 R19.2 U2.14(D11)
D12_ENC_KEY: CN3.4 R21.2 SW1.D U2.15(D12)
DEC1: CN2.2
DEC3: CN2.1
DEC4: CN2.3
DEC6: CN2.4
DEC8: CN2.5
NET1: R10.1
NET2: D6.1(K) Q2.2(C)
NET3: Q3.2(C)
NET4: Q4.2(C)
NET5: R16.2
Net-(C5-1): C5.1 D2.1(K) R13.2 R14.1
Net-(C6-1): C6.1 C8.2 D3.1(K) D4.2(A)
Net-(C7-1): C7.1 D4.1(K) D5.2(A)
Net-(C7-2): C7.2 D3.2(A) R14.2
Net-(C8-1): C8.1 D5.1(K) R16.1
Net-(D1-1): D1.1(C) Q5.1(G) Q6.3(E)
Net-(D1-2): D1.2(A) Q6.2(B) R11.2 R12.2
Net-(D2-2): D2.2(A) L1.2 Q5.2(D)
Net-(D6-2): D6.2(A) Q1.2(C) R10.2
Net-(Q1-1): Q1.1(B) R2.2 R8.2
Net-(Q2-1): Q2.1(B) R3.2 R7.2
Net-(Q3-1): Q3.1(B) R4.2 R6.2
Net-(Q4-1): Q4.1(B) R5.2 R9.2
Net-(R17-2): R17.2 R18.1 SW1.A
Net-(R19-1): R19.1 R20.2 SW1.B

Not connected (* = marked no-connect by the designer): U2 1(D1/TX) 2(D0/RX) 3(RESET) 16(D13) 17(3V3) 18(AREF) 19(A0) 20(A1) 21(A2) 22(A3) 26(A7) 28(RESET) 30(VIN)

# Schematic Schematic3
Board Name: Upper board; Create Date: 2026-03-22; Page Name: P1; Project Name: Decatron; Schematic Name: Schematic3; Update Date: 2026-03-22; Add into BOM: yes; Convert to PCB: yes
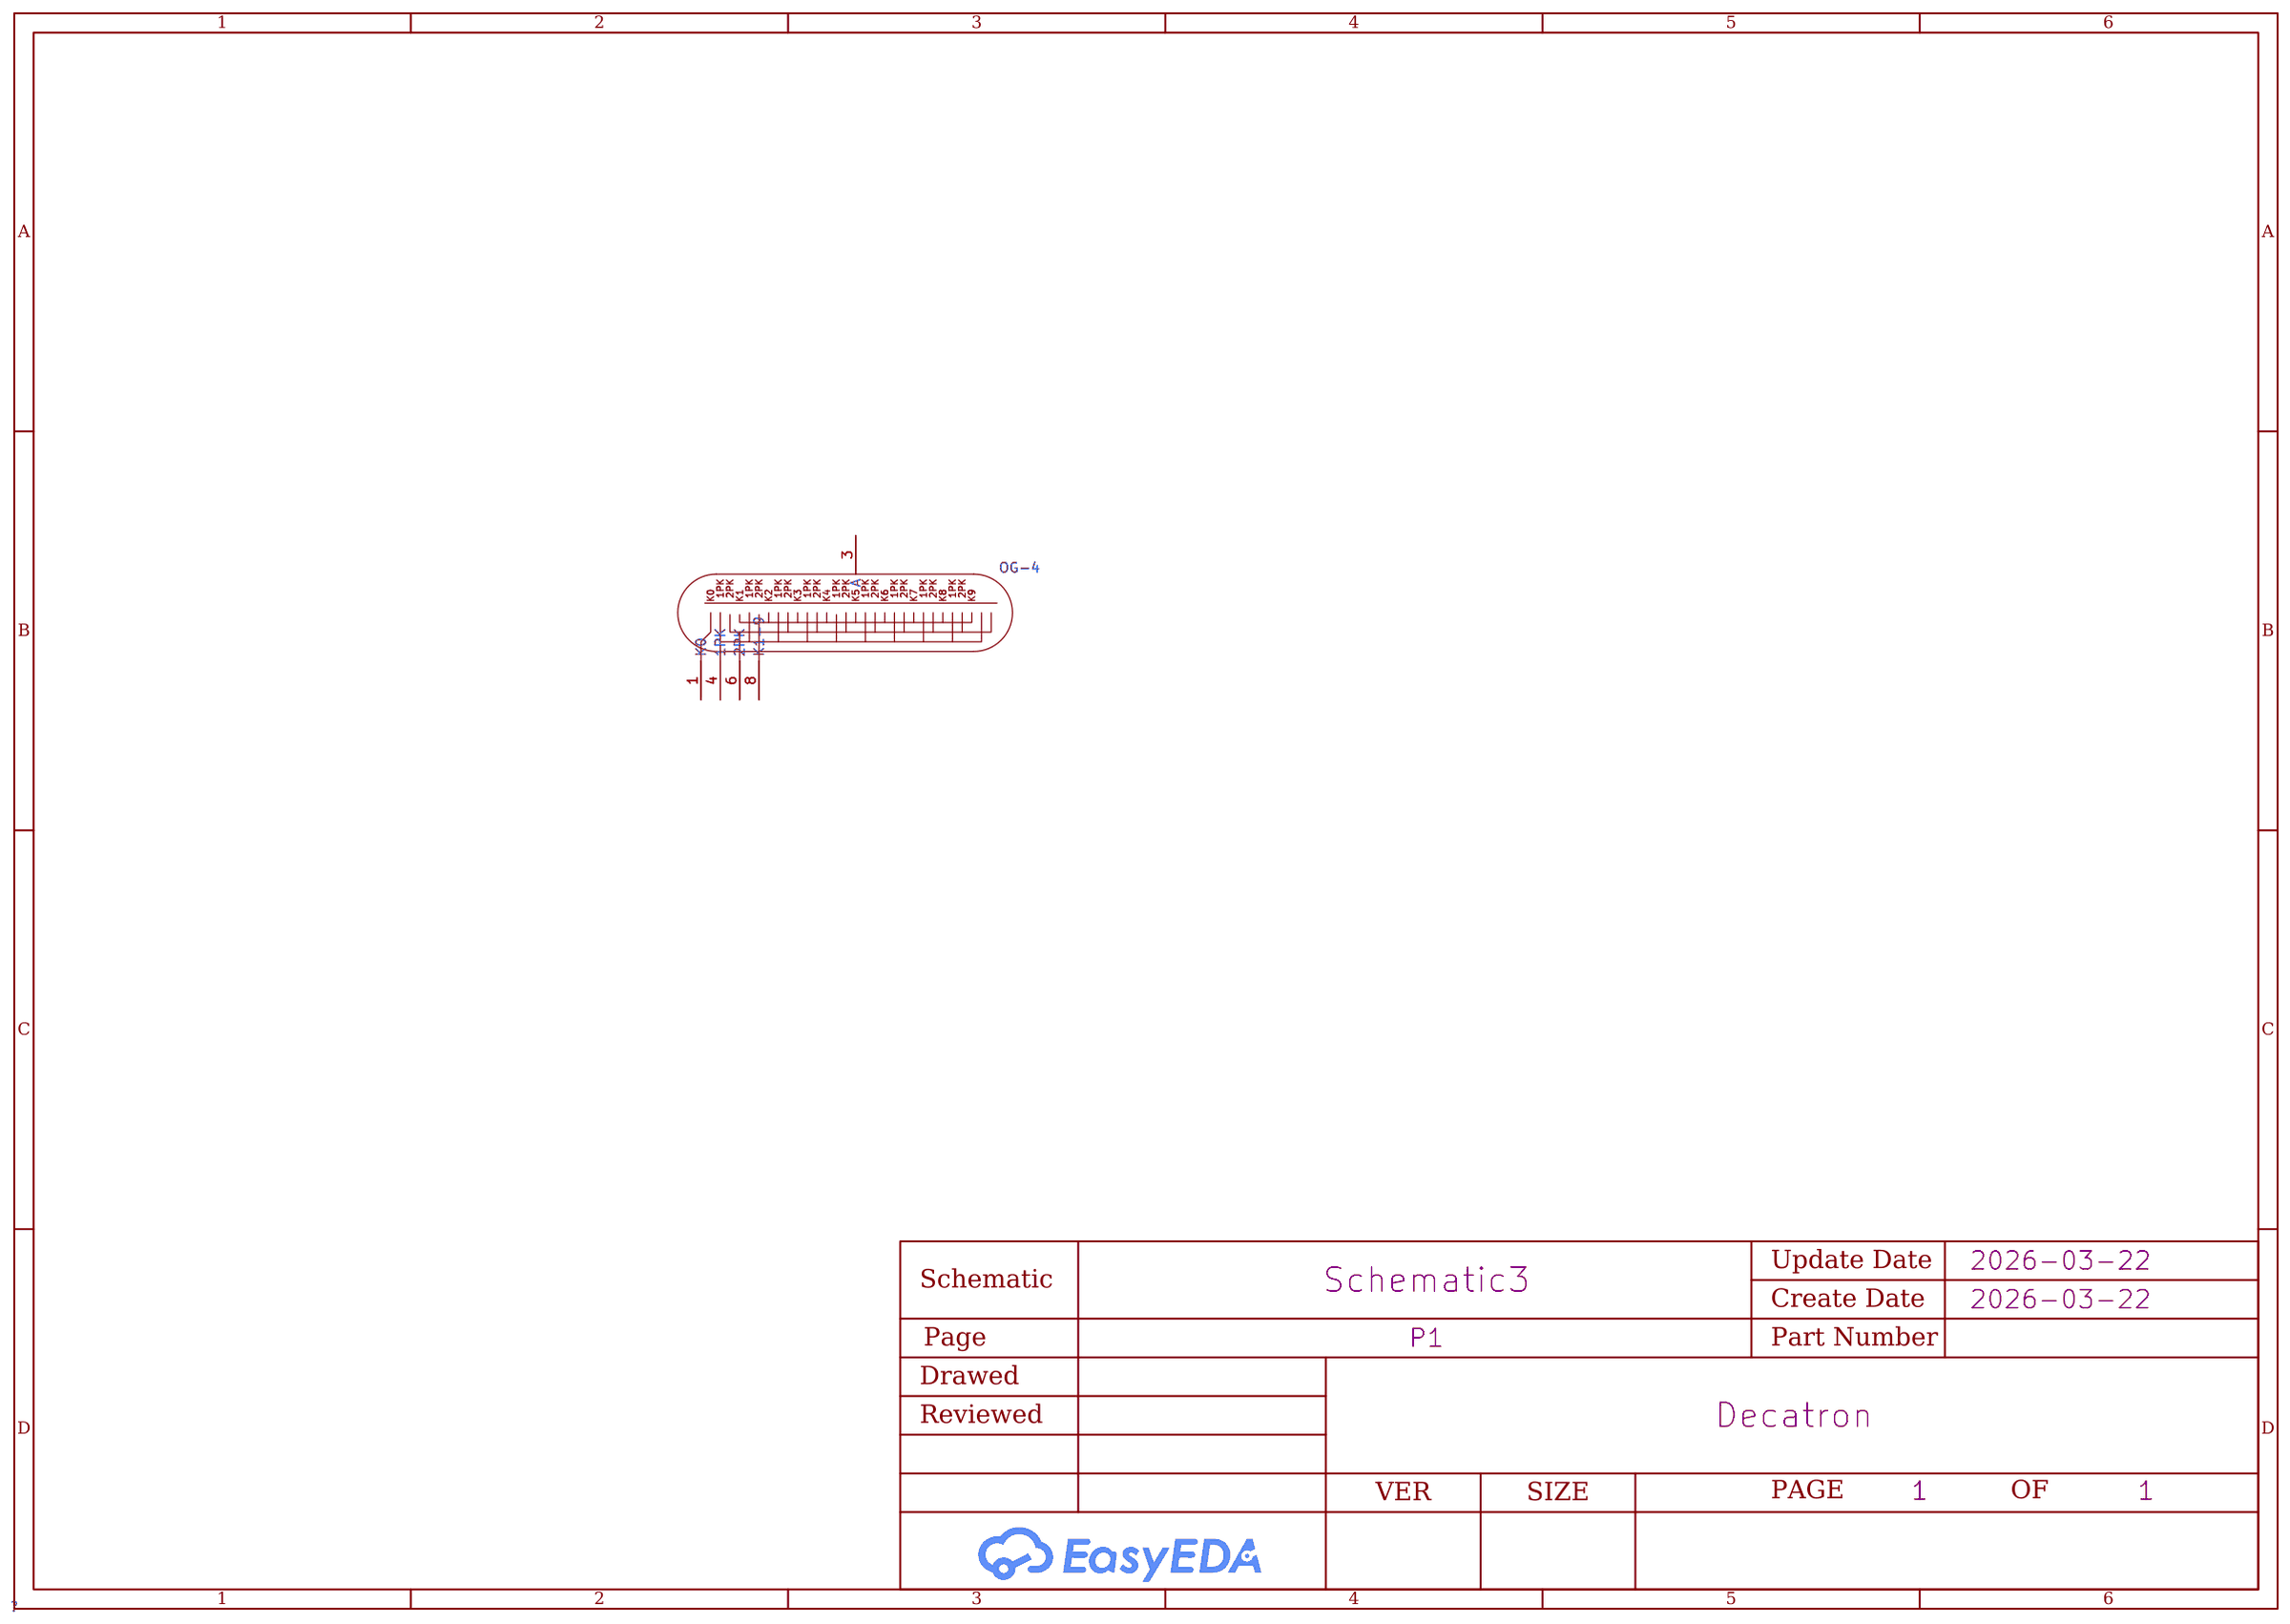
[diagram p2: schematic sheet]

## Parts
U12  OG-4

## Library data of the parts
U12 = OG-4: Manufacturer: none; Manufacturer Part: dekatron OG-4; Supplier Part: none; link: https://www.istok2.com/data/2143/

## Nets

Not connected (* = marked no-connect by the designer): U12 1(K0) 3(A) 4(1PK) 6(2PK) 8(K1-9)

# Board PCB1
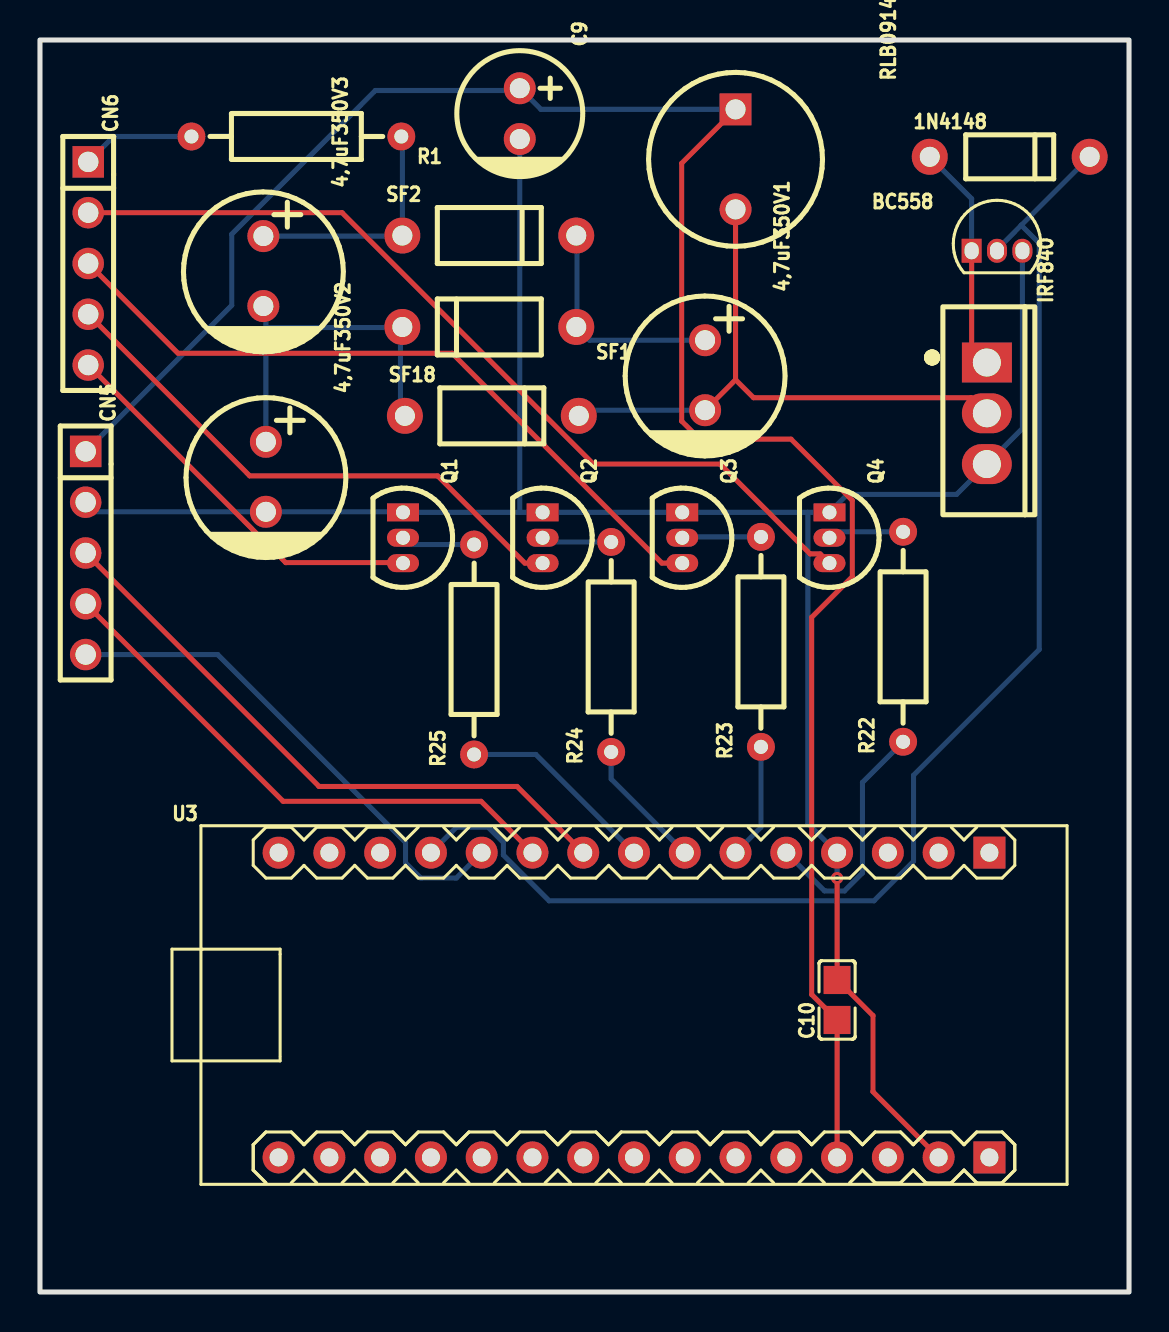
[diagram p3: board, top side]
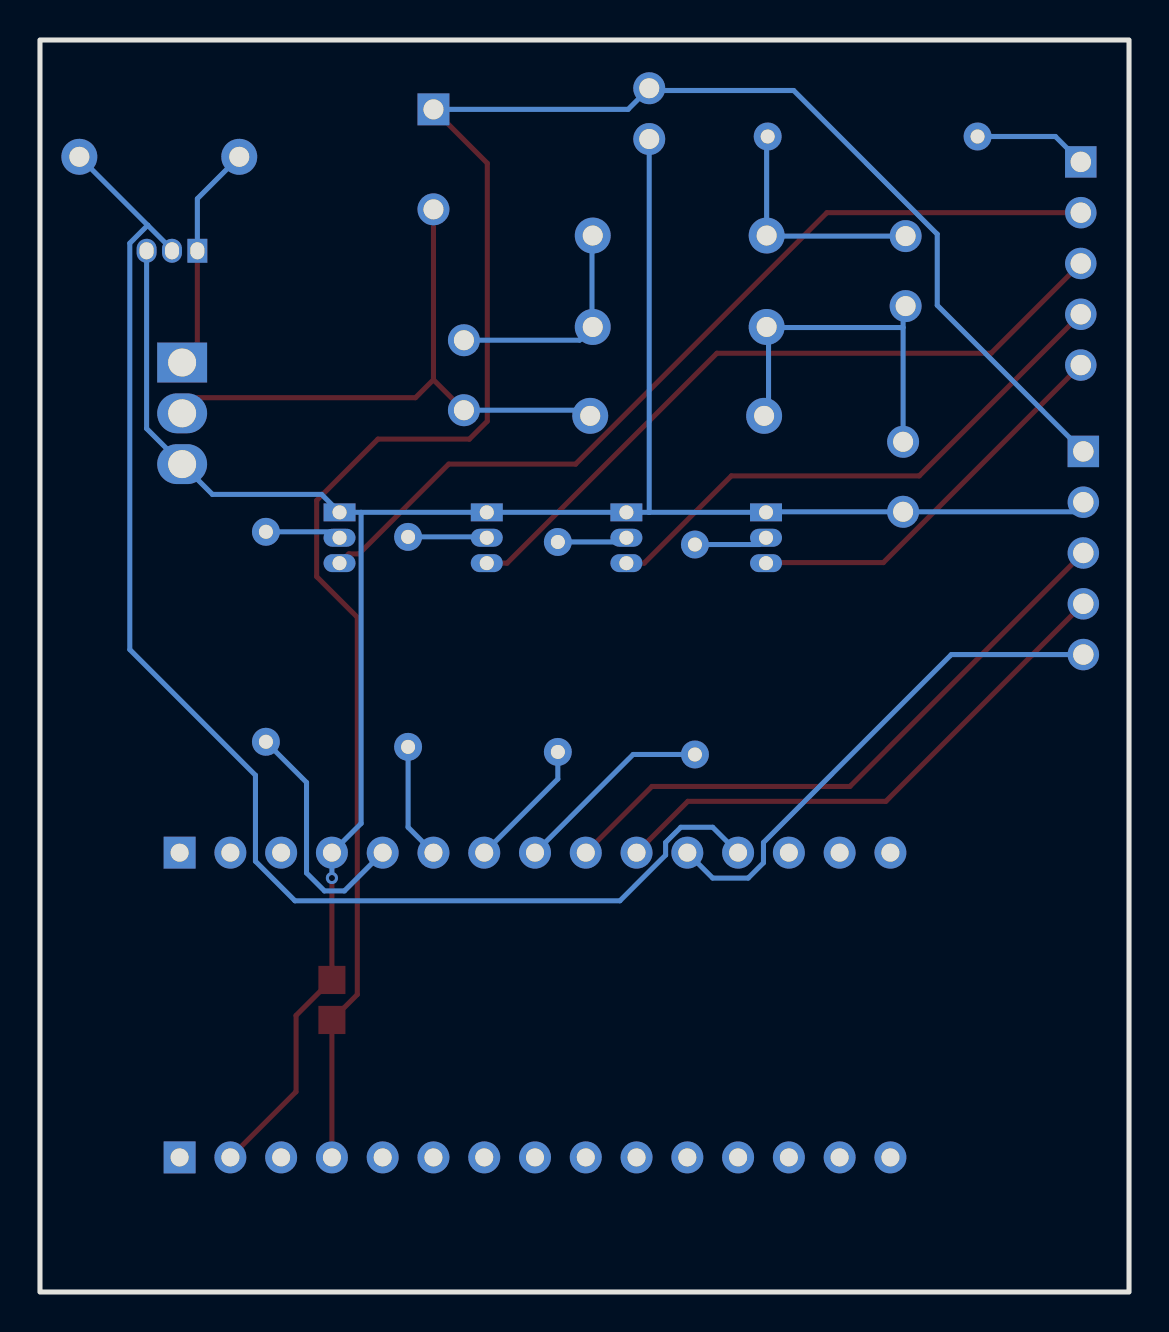
[diagram p4: board, bottom side, seen from below]

Outline 54.48 x 62.61 mm; copper layers: Top Layer, Bottom Layer. Coordinates in mm from the lower left corner of the outline.
Outline path: rectangle 0,62.61 54.48,0
Stack: Top Layer 0.035mm / Dielectric1 1.51mm FR4 er 4.5 / Bottom Layer 0.035mm

## Design rules (mm)
template: JLCPCB Capability(Two Layers Board)
spacing copperThickness1oz (default): track to track 0.102, other pairs 0.152 to 0.3
spacing copperThickness2oz: track to track 0.203, other pairs 0.152 to 0.3
track width copperThickness1oz (default): min 0.127, default 0.254, max 2.54
track width copperThickness2oz: min 0.203, default 0.254, max 2.54
differential pair differentialPair (default): width min 0.127, default 0.254, max 2.54; gap min 0.152, default 0.152
via viaSize (default): diameter min 0.5, default 0.61, max 10; hole min 0.3, default 0.305, max 6.3

## Placement (name value [footprint] x y rotation side)
1N4148  1N4148  [DO-35_BD2.0-L4.0-P8.00-D0.5-FD]  48.51 56.77 0 top
4,7uF350V1  4.7uF  [CAP-TH_BD8.0-P3.50-D0.6-FD_1]  33.27 45.85 270 top
4,7uF350V2  4.7uF  [CAP-TH_BD8.0-P3.50-D0.6-FD_1]  11.3 40.77 270 top
4,7uF350V3  4.7uF  [CAP-TH_BD8.0-P3.50-D0.6-FD_1]  11.18 51.05 270 top
BC558  BC558  [TO-92-3_L4.5-W3.5-P1.27-L]  47.88 52.07 0 top
C9  470uF  [CAP-TH_BD6.3-P2.50-D1.0-FD]  24 58.93 270 top
C10  1uF  [C0805]  39.88 14.6 90 top
CN5  HX PM2.54-1x5P ZC-Y  [HDR-TH_5P-P2.54-V-F-3]  2.29 36.96 270 top
CN6  HX PM2.54-1x5P ZC-Y  [HDR-TH_5P-P2.54-V-F-3]  2.41 51.44 270 top
IRF840  IRF840  [TO-220AB-3_L10.4-W4.6-P2.54-L]  47.37 43.94 270 top
Q1  MPSA42  [TO-92-3_L4.9-W3.7-P1.27-L]  18.16 37.72 270 top
Q2  MPSA42  [TO-92-3_L4.9-W3.7-P1.27-L]  25.15 37.72 270 top
Q3  MPSA42  [TO-92-3_L4.9-W3.7-P1.27-L]  32.13 37.72 270 top
Q4  MPSA42  [TO-92-3_L4.9-W3.7-P1.27-L]  39.5 37.72 270 top
R1  470kΩ  [RES-TH_BD2.3-L6.5-P10.50-D0.5]  12.83 57.78 180 top
R22  4.7kΩ  [RES-TH_BD2.3-L6.5-P10.50-D0.5]  43.18 32.77 90 top
R23  4.7kΩ  [RES-TH_BD2.3-L6.5-P10.50-D0.5]  36.07 32.51 90 top
R24  4.7kΩ  [RES-TH_BD2.3-L6.5-P10.50-D0.5]  28.58 32.26 90 top
R25  4.7kΩ  [RES-TH_BD2.3-L6.5-P10.50-D0.5]  21.72 32.13 90 top
RLB0914-471KL(470uH)1  470uH  [IND-TH_BD8.7-P5.0-D0.7_RLB0914]  34.8 56.64 270 top
SF1  SF18  [DO-41_BD2.4-L4.7-P8.70-D0.9-FD]  22.48 48.26 180 top
SF2  SF18  [DO-41_BD2.4-L4.7-P8.70-D0.9-FD]  22.48 52.83 0 top
SF18  SF18  [DO-41_BD2.4-L4.7-P8.70-D0.9-FD]  22.61 43.81 0 top
U3  ARDUINO_NANO  [COMM-TH_ARDUINO_NANO]  29.72 14.35 0 top

## Footprints (pads in the part's own frame, mm; a bottom-side part is the same pattern mirrored in y, then rotated)
C0805
  rect 1.41x1.35 smd: 1(-1,0) 2(1,0)
CAP-TH_BD6.3-P2.50-D1.0-FD
  round 1.6 hole 1: 1(-1.27,0) 2(1.27,0)
CAP-TH_BD8.0-P3.50-D0.6-FD_1
  round 1.6 hole 1: 1(-1.75,0) 2(1.75,0)
COMM-TH_ARDUINO_NANO
  rect 1.6x1.6 hole 0.9: 1(17.78,7.62) 30(17.78,-7.62)
  round 1.6 hole 0.9: 2(15.24,7.62) 3(12.7,7.62) 4(10.16,7.62) 5(7.62,7.62) 6(5.08,7.62) 7(2.54,7.62) 8(0,7.62) 9(-2.54,7.62) 10(-5.08,7.62) 11(-7.62,7.62) 12(-10.16,7.62) 13(-12.7,7.62) 14(-15.24,7.62) 15(-17.78,7.62) 16(-17.78,-7.62) 17(-15.24,-7.62) 18(-12.7,-7.62) 19(-10.16,-7.62) 20(-7.62,-7.62) 21(-5.08,-7.62) 22(-2.54,-7.62) 23(0,-7.62) 24(2.54,-7.62) 25(5.08,-7.62) 26(7.62,-7.62) 27(10.16,-7.62) 28(12.7,-7.62) 29(15.24,-7.62)
DO-35_BD2.0-L4.0-P8.00-D0.5-FD
  round 1.8 hole 1: 1(-4,0) 2(4,0)
DO-41_BD2.4-L4.7-P8.70-D0.9-FD
  round 1.8 hole 1: 1(-4.35,0) 2(4.35,0)
HDR-TH_5P-P2.54-V-F-3
  rect 1.575x1.575 hole 1.02: 1(-5.08,0)
  round 1.575 hole 1.02: 2(-2.54,0) 3(0,0) 4(2.54,0) 5(5.08,0)
IND-TH_BD8.7-P5.0-D0.7_RLB0914
  rect 1.6x1.6 hole 1: 1(-2.5,0)
  round 1.6 hole 1: 2(2.5,0)
RES-TH_BD2.3-L6.5-P10.50-D0.5
  round 1.4 hole 0.7: 1(-5.25,0) 2(5.25,0)
TO-92-3_L4.5-W3.5-P1.27-L
  rect 1x1.2 hole 0.7x0.85: 1(-1.27,0)
  oval 1x1.2 hole 0.7x0.85: 2(0,0) 3(1.27,0)
TO-92-3_L4.9-W3.7-P1.27-L
  rect 0.9x1.6 hole 0.7: 1(-1.27,0)
  oval 0.9x1.6 hole 0.7: 2(0,0) 3(1.27,0)
TO-220AB-3_L10.4-W4.6-P2.54-L
  rect 2x2.5 hole 1.4: 1(-2.54,0)
  oval 2x2.5 hole 1.4: 2(0,0) 3(2.54,0)

## Nets
As in the schematic.

Pads without a net: U3 1 2 3 13 14 15 16 17 18 19 20 21 22 23 24 25 26 28 30

## Via types
v1: diameter 0.61, hole 0.305, Top Layer to Bottom Layer, 1 via

## Routing (per net, layer and track width the routed paths; a pad name or vN(x,y) marks a point on that pad's centre or on a via; arc(x,y) is an arc through that point)
+5V: length 103.7
  Top Layer w0.254: RLB0914-471KL(470uH)1.1 32.1,56.45 32.1,43.55 33,42.65 37.57,42.65 40.64,39.58 40.64,35.77 38.61,33.74 38.61,14.88 C10.1 U3.27
  Bottom Layer w0.254: 24.12,60.08 25.06,59.14 RLB0914-471KL(470uH)1.1 ; 24.12,60.08 16.78,60.08 9.59,52.9 9.59,49.34 CN5.1 ; 24.12,60.08 C9.1
GND: length 111.4
  Top Layer w0.254: 39.88,15.62 41.67,13.82 41.67,10.02 U3.29 ; 39.88,15.62 v1(39.88,20.7) ; 39.88,15.62 C10.2
  Bottom Layer w0.254: BC558.3 49.15,43.18 IRF840.3 45.86,39.89 40.39,39.89 Q4.1 38.42,38.99 ; 24,38.99 Q1.1 18.13,39.02 4,7uF350V2.2 2.77,39.02 CN5.2 ; 24,38.99 C9.2 ; 24,38.99 Q2.1 Q3.1 38.42,38.99 ; 38.42,38.99 38.42,23.43 39.88,21.97 v1(39.88,20.7)
D2_K0: length 12.4
  Bottom Layer w0.254: 37.34,21.97 39.25,20.06 40.25,20.06 41.15,20.95 41.15,25.48 R22.1
D3_PK1: length 5.8
  Bottom Layer w0.254: 34.8,21.97 36.07,23.24 R23.1
D4_PK2: length 6.6
  Bottom Layer w0.254: R24.1 28.58,25.65 32.26,21.97
D5_K: length 10
  Bottom Layer w0.254: 29.72,21.97 24.81,26.88 R25.1
D6_BTN1: length 31.1
  Top Layer w0.254: 27.18,21.97 23.87,25.28 13.96,25.28 CN5.3
D7_BTN2: length 27.5
  Top Layer w0.254: 2.29,34.42 12.16,24.54 22.07,24.54 24.64,21.97
D8_BTN3: length 25.6
  Bottom Layer w0.254: CN5.5 8.89,31.88 18.29,22.48 18.29,21.46 19.05,20.7 20.83,20.7 22.1,21.97
D9_GEN: length 68.8
  Bottom Layer w0.254: 49.09,53.35 49.99,52.45 49.99,32.13 43.7,25.84 43.7,21.54 41.73,19.56 25.47,19.56 23.18,21.85 23.18,22.48 22.42,23.24 20.83,23.24 19.56,21.97 ; 49.09,53.35 47.88,52.13 BC558.2 ; 49.09,53.35 1N4148.2
DEC1: length 44.3
  Top Layer w0.254: 2.41,53.97 15.11,53.97 27.69,41.4 34.04,41.4 38.53,36.91 39.03,36.91 Q4.3
DEC3: length 5.7
  Bottom Layer w0.254: CN6.1 3.68,57.78 R1.2
DEC4: length 35.9
  Top Layer w0.254: Q3.3 31.11,36.45 20.62,46.94 6.9,46.94 CN6.3
DEC6: length 27.9
  Top Layer w0.254: CN6.4 10.49,40.81 19.89,40.81 24.26,36.45 Q2.3
DEC8: length 19.9
  Top Layer w0.254: Q1.3 18.13,36.48 12.29,36.48 2.41,46.35
$1N16358: length 11.3
  Bottom Layer w0.254: 26.86,48.23 SF1.1 ; 26.86,48.23 26.86,52.8 SF2.2 ; 26.86,48.23 27.49,47.6 4,7uF350V1.1
$1N16362: length 11.9
  Bottom Layer w0.254: R1.1 18.13,57.73 SF2.1 18.1,52.8 4,7uF350V3.1
$1N16381: length 18.2
  Bottom Layer w0.254: SF1.2 18.1,48.23 18.03,48.23 ; SF18.1 18.03,44.04 18.03,48.23 ; 18.03,48.23 11.3,48.23 ; 11.3,48.23 11.3,49.18 4,7uF350V3.2 ; 11.3,48.23 4,7uF350V2.1
$1N16382: length 30.4
  Top Layer w0.254: 4,7uF350V1.2 34.8,45.62 ; 34.8,45.62 RLB0914-471KL(470uH)1.2 ; 34.8,45.62 35.7,44.72 46.59,44.72 IRF840.2
  Bottom Layer w0.254: SF18.2 27.24,44.1 4,7uF350V1.2
$1N16384: length 3.5
  Bottom Layer w0.254: R24.2 25.36,37.51 Q2.2
$1N16385: length 3.7
  Bottom Layer w0.254: Q1.2 18.5,37.38 R25.2
$1N16390: length 4
  Bottom Layer w0.254: Q3.2 32.17,37.76 R23.2
$1N16391: length 3.8
  Bottom Layer w0.254: Q4.2 39.79,38.02 R22.2
$1N16392: length 11.5
  Top Layer w0.254: BC558.1 46.61,47.24 IRF840.1
  Bottom Layer w0.254: BC558.1 46.61,54.67 1N4148.1
